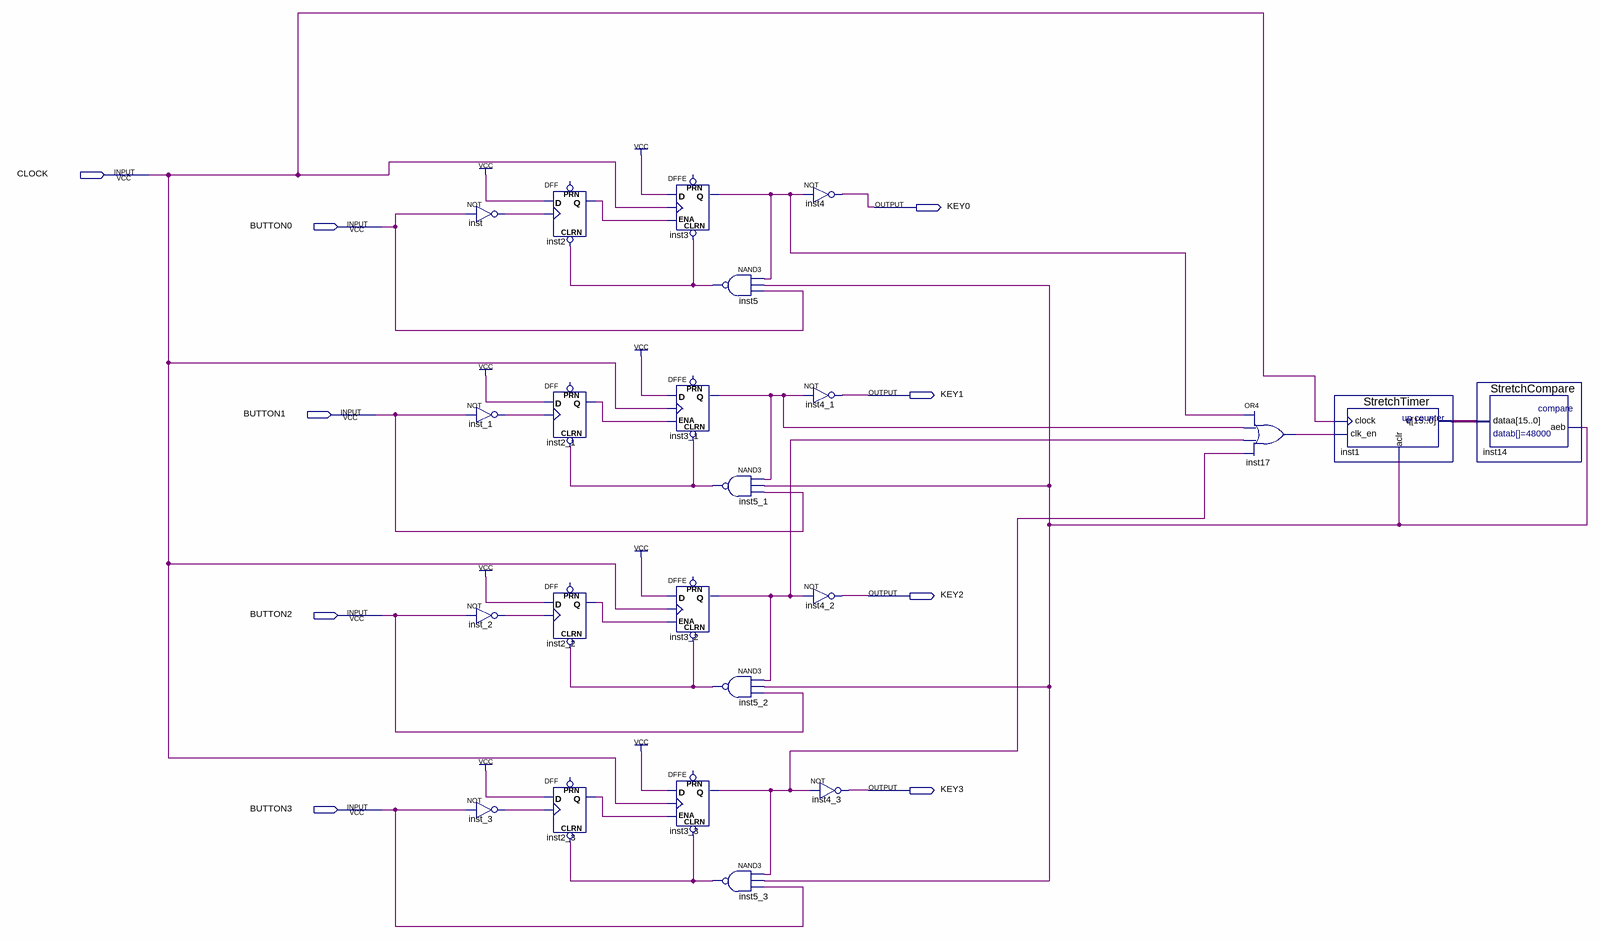
[diagram p0: schematic sheet]
// Quartus schematic Button_Debounce.bdf as structural Verilog: 23 symbols, 9 pins
module Button_Debounce (
  input  CLOCK,
  input  BUTTON0,
  input  BUTTON1,
  input  BUTTON2,
  input  BUTTON3,
  output KEY0,
  output KEY1,
  output KEY2,
  output KEY3
);

  wire inst2_1_q, inst2_2_q, inst2_3_q, inst2_q, inst3_1_q, inst3_2_q, inst3_3_q, inst3_q, inst5_1_out,
       inst5_2_out, inst5_3_out, inst5_out, inst14_aeb, inst17_out, inst_1_out, inst_2_out, inst_3_out,
       inst_out;
  wire [15:0] inst1_q;

  not inst (inst_out, BUTTON0);
  not inst_1 (inst_1_out, BUTTON1);
  not inst_2 (inst_2_out, BUTTON2);
  not inst_3 (inst_3_out, BUTTON3);
  DFF inst2 (.CLRN(inst5_out), .CLK(inst_out), .D(1'b1), .Q(inst2_q));  // open: PRN
  DFF inst2_1 (.CLRN(inst5_1_out), .CLK(inst_1_out), .D(1'b1), .Q(inst2_1_q));  // open: PRN
  DFF inst2_2 (.CLRN(inst5_2_out), .CLK(inst_2_out), .D(1'b1), .Q(inst2_2_q));  // open: PRN
  DFF inst2_3 (.CLRN(inst5_3_out), .CLK(inst_3_out), .D(1'b1), .Q(inst2_3_q));  // open: PRN
  DFFE inst3 (.CLRN(inst5_out), .D(1'b1), .CLK(CLOCK), .ENA(inst2_q), .Q(inst3_q));  // open: PRN
  DFFE inst3_1 (.CLRN(inst5_1_out), .D(1'b1), .CLK(CLOCK), .ENA(inst2_1_q), .Q(inst3_1_q));  // open: PRN
  DFFE inst3_2 (.CLRN(inst5_2_out), .D(1'b1), .CLK(CLOCK), .ENA(inst2_2_q), .Q(inst3_2_q));  // open: PRN
  DFFE inst3_3 (.CLRN(inst5_3_out), .D(1'b1), .CLK(CLOCK), .ENA(inst2_3_q), .Q(inst3_3_q));  // open: PRN
  nand inst5 (inst5_out, inst3_q, inst14_aeb, BUTTON0);
  nand inst5_1 (inst5_1_out, inst3_1_q, inst14_aeb, BUTTON1);
  nand inst5_2 (inst5_2_out, inst3_2_q, inst14_aeb, BUTTON2);
  nand inst5_3 (inst5_3_out, inst3_3_q, inst14_aeb, BUTTON3);
  not inst4 (KEY0, inst3_q);
  not inst4_1 (KEY1, inst3_1_q);
  not inst4_2 (KEY2, inst3_2_q);
  not inst4_3 (KEY3, inst3_3_q);
  or inst17 (inst17_out, inst3_q, inst3_1_q, inst3_2_q, inst3_3_q);
  StretchTimer inst1 (.clock(CLOCK), .clk_en(inst17_out), .aclr(inst14_aeb), .q(inst1_q));
  StretchCompare inst14 (.dataa(inst1_q), .aeb(inst14_aeb));
endmodule
